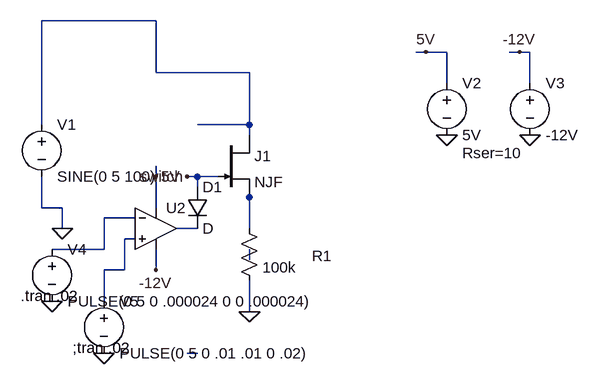
[diagram p0: schematic jfet_switch.asc]
jfet_switch.asc, the LTspice schematic file:
Version 4
SHEET 1 880 680
WIRE 0 -48 -176 -48
WIRE 416 0 400 0
WIRE 448 0 416 0
WIRE 560 0 544 0
WIRE 576 0 560 0
WIRE 0 32 0 -48
WIRE 144 32 0 32
WIRE 448 48 448 0
WIRE 576 48 576 0
WIRE -176 112 -176 -48
WIRE 144 112 144 32
WIRE 144 112 64 112
WIRE 144 128 144 112
WIRE 0 192 0 176
WIRE 64 192 48 192
WIRE 96 192 64 192
WIRE 64 208 64 192
WIRE 144 224 144 208
WIRE -176 240 -176 192
WIRE -144 240 -176 240
WIRE 0 240 0 192
WIRE -32 256 -80 256
WIRE -144 272 -144 240
WIRE 64 272 32 272
WIRE 144 272 144 224
WIRE -32 288 -48 288
WIRE -80 304 -80 256
WIRE -80 304 -160 304
WIRE 144 320 144 304
WIRE -48 336 -48 288
WIRE -48 336 -80 336
WIRE 0 336 0 304
WIRE -80 384 -80 336
WIRE 144 400 144 352
WIRE 64 464 48 464
FLAG -144 272 0
FLAG 144 400 0
FLAG 448 128 0
FLAG 576 128 0
FLAG 416 0 5V
FLAG 560 0 -12V
FLAG -160 384 0
FLAG -80 464 0
FLAG 0 192 5V
FLAG 48 192 switch
FLAG 0 336 -12V
SYMBOL voltage -176 96 R0
WINDOW 123 0 0 Left 2
WINDOW 39 0 0 Left 2
SYMATTR InstName V1
SYMATTR Value SINE(0 5 100)
SYMBOL res 128 256 R0
WINDOW 0 112 58 Left 2
SYMATTR InstName R1
SYMATTR Value 100k
SYMBOL njf 96 128 R0
SYMATTR InstName J1
SYMBOL voltage 448 32 R0
WINDOW 123 0 0 Left 2
WINDOW 39 24 124 Left 2
SYMATTR SpiceLine Rser=10
SYMATTR InstName V2
SYMATTR Value 5V
SYMBOL voltage 576 32 R0
WINDOW 123 0 0 Left 2
WINDOW 39 0 0 Left 2
SYMATTR InstName V3
SYMATTR Value -12V
SYMBOL voltage -160 288 R0
WINDOW 123 0 0 Left 2
WINDOW 39 0 0 Left 2
SYMATTR InstName V4
SYMATTR Value PULSE(0 5 0 .000024 0 0 .000024)
SYMBOL voltage -80 368 R0
WINDOW 123 0 0 Left 2
WINDOW 39 0 0 Left 2
SYMATTR InstName V5
SYMATTR Value PULSE(0 5 0 .01 .01 0 .02)
SYMBOL Opamps\\UniversalOpamp2 0 272 R0
SYMATTR InstName U2
SYMATTR Value2 Avol=13Meg GBW=13Meg Slew=13Meg
SYMBOL diode 48 208 R0
SYMATTR InstName D1
TEXT -208 376 Left 2 !.tran .02
TEXT -128 456 Left 2 !;tran .02

The netlist it stands for:
* jfet_switch.asc
V1 N001 0 SINE(0 5 100)
R1 N002 0 100k
J1 N001 switch N002 NJF
V2 5V 0 5V Rser=10
V3 -12V 0 -12V
V4 N003 0 PULSE(0 5 0 .000024 0 0 .000024)
V5 N005 0 PULSE(0 5 0 .01 .01 0 .02)
XU2 N005 N003 5V -12V N004 level.2 Avol=13Meg GBW=13Meg Slew=13Meg ilimit=25m rail=0 Vos=0 phimargin=45 en=0 enk=0 in=0 ink=0 Rin=500Meg  ; pins IN+ IN- V+ V- OUT
D1 switch N004 D
.model D D
.lib standard.dio
.model NJF NJF
.model PJF PJF
.lib standard.jft
.tran .02
;tran .02
.lib UniversalOpamps2.sub
.backanno
.end